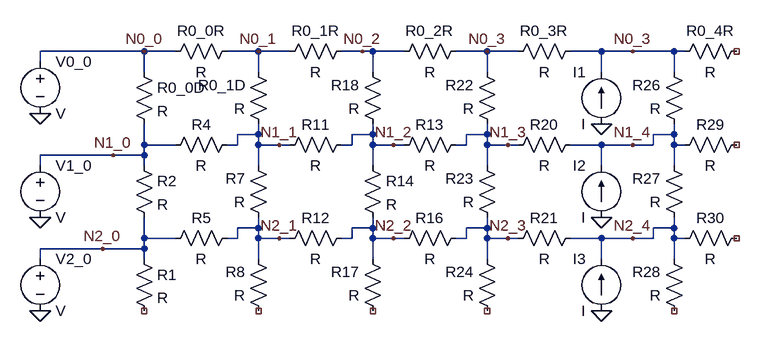
[diagram p0: schematic meshcircuit.asc]
meshcircuit.asc, the LTspice schematic file:
Version 4
SHEET 1 1064 680
WIRE 144 112 -16 112
WIRE 192 112 144 112
WIRE 320 112 272 112
WIRE 368 112 320 112
WIRE 480 112 448 112
WIRE 496 112 480 112
WIRE 544 112 496 112
WIRE 672 112 624 112
WIRE 720 112 672 112
WIRE 848 112 800 112
WIRE 896 112 848 112
WIRE 960 112 896 112
WIRE 976 112 960 112
WIRE -16 128 -16 112
WIRE 144 144 144 112
WIRE 320 144 320 112
WIRE 496 144 496 112
WIRE 672 144 672 112
WIRE 848 144 848 112
WIRE 960 144 960 112
WIRE 320 240 320 224
WIRE 320 240 288 240
WIRE 496 240 496 224
WIRE 496 240 464 240
WIRE 672 240 672 224
WIRE 672 240 640 240
WIRE 960 240 960 224
WIRE 960 240 928 240
WIRE 144 256 144 224
WIRE 192 256 144 256
WIRE 288 256 288 240
WIRE 288 256 272 256
WIRE 320 256 320 240
WIRE 352 256 320 256
WIRE 368 256 352 256
WIRE 464 256 464 240
WIRE 464 256 448 256
WIRE 496 256 496 240
WIRE 528 256 496 256
WIRE 544 256 528 256
WIRE 640 256 640 240
WIRE 640 256 624 256
WIRE 672 256 672 240
WIRE 704 256 672 256
WIRE 720 256 704 256
WIRE 848 256 800 256
WIRE 896 256 848 256
WIRE 928 256 928 240
WIRE 928 256 896 256
WIRE 960 256 960 240
WIRE 976 256 960 256
WIRE 96 272 -16 272
WIRE 144 272 144 256
WIRE 144 272 96 272
WIRE -16 288 -16 272
WIRE 144 288 144 272
WIRE 320 288 320 256
WIRE 496 288 496 256
WIRE 672 288 672 256
WIRE 848 288 848 256
WIRE 960 288 960 256
WIRE 320 384 320 368
WIRE 320 384 288 384
WIRE 496 384 496 368
WIRE 496 384 464 384
WIRE 672 384 672 368
WIRE 672 384 640 384
WIRE 960 384 960 368
WIRE 960 384 928 384
WIRE 144 400 144 368
WIRE 192 400 144 400
WIRE 288 400 288 384
WIRE 288 400 272 400
WIRE 320 400 320 384
WIRE 352 400 320 400
WIRE 368 400 352 400
WIRE 464 400 464 384
WIRE 464 400 448 400
WIRE 496 400 496 384
WIRE 528 400 496 400
WIRE 544 400 528 400
WIRE 640 400 640 384
WIRE 640 400 624 400
WIRE 672 400 672 384
WIRE 704 400 672 400
WIRE 720 400 704 400
WIRE 848 400 800 400
WIRE 896 400 848 400
WIRE 928 400 928 384
WIRE 928 400 896 400
WIRE 960 400 960 384
WIRE 976 400 960 400
WIRE 80 416 -16 416
WIRE 144 416 144 400
WIRE 144 416 80 416
WIRE -16 432 -16 416
WIRE 144 432 144 416
WIRE 320 432 320 400
WIRE 496 432 496 400
WIRE 672 432 672 400
WIRE 848 432 848 400
WIRE 960 432 960 400
FLAG -16 368 0
FLAG -16 512 0
FLAG 848 224 0
FLAG 848 368 0
FLAG 848 512 0
FLAG -16 208 0
FLAG 144 112 N0_0
FLAG 320 112 N0_1
FLAG 480 112 N0_2
FLAG 672 112 N0_3
FLAG 896 112 N0_3
FLAG 96 272 N1_0
FLAG 352 256 N1_1
FLAG 528 256 N1_2
FLAG 704 256 N1_3
FLAG 896 256 N1_4
FLAG 80 416 N2_0
FLAG 352 400 N2_1
FLAG 528 400 N2_2
FLAG 704 400 N2_3
FLAG 896 400 N2_4
SYMBOL res 128 416 R0
SYMATTR InstName R1
SYMBOL res 128 272 R0
SYMATTR InstName R2
SYMBOL res 128 128 R0
SYMATTR InstName R0_0D
SYMBOL res 288 240 R90
WINDOW 0 0 56 VBottom 2
WINDOW 3 32 56 VTop 2
SYMATTR InstName R4
SYMBOL res 288 384 R90
WINDOW 0 0 56 VBottom 2
WINDOW 3 32 56 VTop 2
SYMATTR InstName R5
SYMBOL res 336 240 R180
WINDOW 0 109 76 Right 2
WINDOW 3 36 40 Left 2
SYMATTR InstName R0_1D
SYMBOL res 336 384 R180
WINDOW 0 36 76 Left 2
WINDOW 3 36 40 Left 2
SYMATTR InstName R7
SYMBOL res 336 528 R180
WINDOW 0 36 76 Left 2
WINDOW 3 36 40 Left 2
SYMATTR InstName R8
SYMBOL res 176 128 R270
WINDOW 0 32 56 VTop 2
WINDOW 3 0 56 VBottom 2
SYMATTR InstName R0_0R
SYMBOL res 352 128 R270
WINDOW 0 32 56 VTop 2
WINDOW 3 0 56 VBottom 2
SYMATTR InstName R0_1R
SYMBOL res 352 272 R270
WINDOW 0 32 56 VTop 2
WINDOW 3 0 56 VBottom 2
SYMATTR InstName R11
SYMBOL res 352 416 R270
WINDOW 0 32 56 VTop 2
WINDOW 3 0 56 VBottom 2
SYMATTR InstName R12
SYMBOL res 480 272 R0
SYMATTR InstName R14
SYMBOL res 528 128 R270
WINDOW 0 32 56 VTop 2
WINDOW 3 0 56 VBottom 2
SYMATTR InstName R0_2R
SYMBOL res 528 416 R270
WINDOW 0 32 56 VTop 2
WINDOW 3 0 56 VBottom 2
SYMATTR InstName R16
SYMBOL res 528 272 R270
WINDOW 0 32 56 VTop 2
WINDOW 3 0 56 VBottom 2
SYMATTR InstName R13
SYMBOL res 512 528 R180
WINDOW 0 36 76 Left 2
WINDOW 3 36 40 Left 2
SYMATTR InstName R17
SYMBOL res 512 240 R180
WINDOW 0 36 76 Left 2
WINDOW 3 36 40 Left 2
SYMATTR InstName R18
SYMBOL res 704 128 R270
WINDOW 0 32 56 VTop 2
WINDOW 3 0 56 VBottom 2
SYMATTR InstName R0_3R
SYMBOL res 704 272 R270
WINDOW 0 32 56 VTop 2
WINDOW 3 0 56 VBottom 2
SYMATTR InstName R20
SYMBOL res 704 416 R270
WINDOW 0 32 56 VTop 2
WINDOW 3 0 56 VBottom 2
SYMATTR InstName R21
SYMBOL res 688 240 R180
WINDOW 0 36 76 Left 2
WINDOW 3 36 40 Left 2
SYMATTR InstName R22
SYMBOL res 688 384 R180
WINDOW 0 36 76 Left 2
WINDOW 3 36 40 Left 2
SYMATTR InstName R23
SYMBOL res 688 528 R180
WINDOW 0 36 76 Left 2
WINDOW 3 36 40 Left 2
SYMATTR InstName R24
SYMBOL voltage -16 112 R0
SYMATTR InstName V0_0
SYMBOL voltage -16 272 R0
SYMATTR InstName V1_0
SYMBOL voltage -16 416 R0
SYMATTR InstName V2_0
SYMBOL current 848 224 R180
WINDOW 0 24 80 Left 2
WINDOW 3 24 0 Left 2
SYMATTR InstName I1
SYMBOL current 848 368 R180
WINDOW 0 24 80 Left 2
WINDOW 3 24 0 Left 2
SYMATTR InstName I2
SYMBOL current 848 512 R180
WINDOW 0 24 80 Left 2
WINDOW 3 24 0 Left 2
SYMATTR InstName I3
SYMBOL res 960 128 R270
WINDOW 0 32 56 VTop 2
WINDOW 3 0 56 VBottom 2
SYMATTR InstName R0_4R
SYMBOL res 976 240 R180
WINDOW 0 36 76 Left 2
WINDOW 3 36 40 Left 2
SYMATTR InstName R26
SYMBOL res 976 384 R180
WINDOW 0 36 76 Left 2
WINDOW 3 36 40 Left 2
SYMATTR InstName R27
SYMBOL res 976 528 R180
WINDOW 0 36 76 Left 2
WINDOW 3 36 40 Left 2
SYMATTR InstName R28
SYMBOL res 960 272 R270
WINDOW 0 32 56 VTop 2
WINDOW 3 0 56 VBottom 2
SYMATTR InstName R29
SYMBOL res 960 416 R270
WINDOW 0 32 56 VTop 2
WINDOW 3 0 56 VBottom 2
SYMATTR InstName R30

The netlist it stands for:
* meshcircuit.asc
R1 N2_0 NC_01 R
R2 N1_0 N2_0 R
R0_0D N0_0 N1_0 R
R4 N1_1 N1_0 R
R5 N2_1 N2_0 R
R0_1D N1_1 N0_1 R
R7 N2_1 N1_1 R
R8 NC_02 N2_1 R
R0_0R N0_0 N0_1 R
R0_1R N0_1 N0_2 R
R11 N1_1 N1_2 R
R12 N2_1 N2_2 R
R14 N1_2 N2_2 R
R0_2R N0_2 N0_3 R
R16 N2_2 N2_3 R
R13 N1_2 N1_3 R
R17 NC_03 N2_2 R
R18 N1_2 N0_2 R
R0_3R N0_3 N0_3 R
R20 N1_3 N1_4 R
R21 N2_3 N2_4 R
R22 N1_3 N0_3 R
R23 N2_3 N1_3 R
R24 NC_04 N2_3 R
V0_0 N0_0 0 V
V1_0 N1_0 0 V
V2_0 N2_0 0 V
I1 0 N0_3 I
I2 0 N1_4 I
I3 0 N2_4 I
R0_4R N0_3 NC_05 R
R26 N1_4 N0_3 R
R27 N2_4 N1_4 R
R28 NC_06 N2_4 R
R29 N1_4 NC_07 R
R30 N2_4 NC_08 R
.backanno
.end